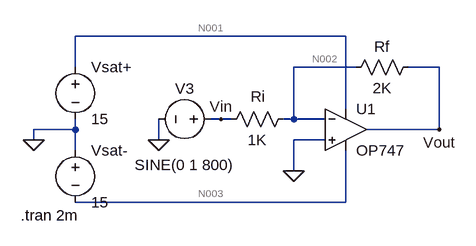
[diagram p0: schematic INVERTING_CKT.asc]
INVERTING_CKT.asc, the LTspice schematic file:
Version 4
SHEET 1 880 680
WIRE 336 16 -80 16
WIRE -80 64 -80 16
WIRE 352 64 256 64
WIRE 480 64 432 64
WIRE 336 128 336 16
WIRE 144 144 128 144
WIRE 160 144 144 144
WIRE 256 144 256 64
WIRE 256 144 240 144
WIRE 304 144 256 144
WIRE -80 160 -80 144
WIRE -80 160 -144 160
WIRE 480 160 480 64
WIRE 480 160 368 160
WIRE -144 176 -144 160
WIRE 48 176 48 144
WIRE 304 176 256 176
WIRE -80 192 -80 160
WIRE 256 224 256 176
WIRE 336 272 336 192
WIRE 336 272 -80 272
FLAG -144 176 0
FLAG 48 176 0
FLAG 256 224 0
FLAG 480 160 Vout
FLAG 144 144 Vin
SYMBOL OpAmps\\OP747 336 96 R0
SYMATTR InstName U1
SYMBOL voltage -80 48 R0
WINDOW 123 0 0 Left 0
WINDOW 39 0 0 Left 0
SYMATTR InstName Vsat+
SYMATTR Value 15
SYMBOL voltage -80 176 R0
WINDOW 123 0 0 Left 0
WINDOW 39 0 0 Left 0
SYMATTR InstName Vsat-
SYMATTR Value 15
SYMBOL voltage 144 144 R90
WINDOW 0 -32 56 VBottom 2
WINDOW 3 55 56 VTop 2
WINDOW 123 0 0 Left 0
WINDOW 39 0 0 Left 0
SYMATTR InstName V3
SYMATTR Value SINE(0 1 800)
SYMBOL res 256 128 R90
WINDOW 0 -3 55 VBottom 2
WINDOW 3 32 56 VTop 2
SYMATTR InstName Ri
SYMATTR Value 1K
SYMBOL res 448 48 R90
WINDOW 0 0 56 VBottom 2
WINDOW 3 32 56 VTop 2
SYMATTR InstName Rf
SYMATTR Value 2K
TEXT -164 292 Left 2 !.tran 2m

The netlist it stands for:
* INVERTING_CKT.asc
XU1 0 N002 N001 N003 Vout OP747  ; pins In+ In- V+ V- OUT
Vsat+ N001 0 15
Vsat- 0 N003 15
V3 Vin 0 SINE(0 1 800)
Ri N002 Vin 1K
Rf Vout N002 2K
.tran 2m
.backanno
.end

* Results of the author's LTspice run, read from the files saved beside the schematic
* Operating Point, zero values left out:
*   V(n002) = 80 µV
*   V(n003) = -15 V
*   V(n001) = 15 V
*   V(vout) = 222.3 µV
*   I(Rf) = 71.14 nA
*   I(Ri) = 80 nA
*   I(V3) = 80 nA
*   I(Vsat-) = -304.3 µA
*   I(Vsat+) = -304.4 µA
*   Ix(u1:1) = -10.86 nA
*   Ix(u1:2) = -8.856 nA
*   Ix(u1:99) = 304.4 µA
*   Ix(u1:50) = -304.3 µA
*   Ix(u1:45) = -71.14 nA
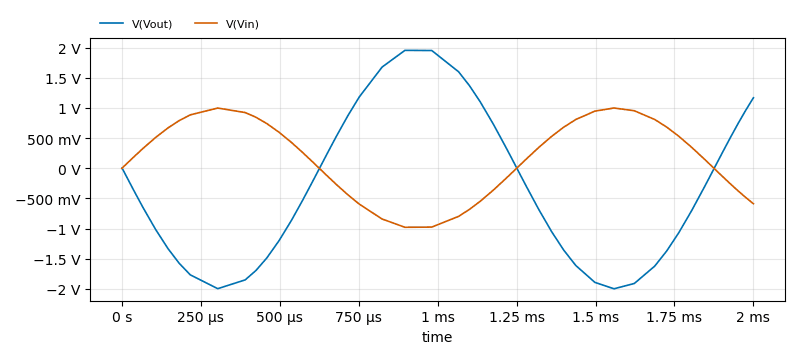
[diagram p1: Transient Analysis of INVERTING_CKT.asc, plotted from the saved traces]
* Transient Analysis, 1 run:
*   V(Vout): min -1.999 V, max 1.956 V, average -358.5 mV, rms 1.372 V, last 1.169 V
*   V(Vin): min -978.6 mV, max 999.8 mV, average 179.1 mV, rms 686.2 mV, last -587.8 mV